# Altium schematic sheet Sheet2.SchDoc
size A4; SheetNumber: 1; SheetTotal: 1
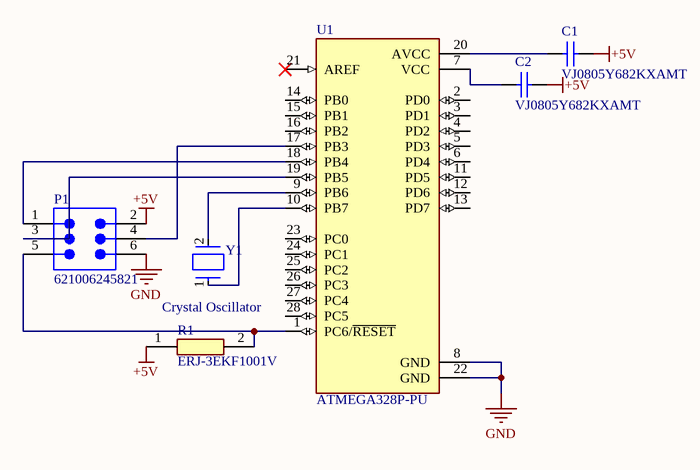
[diagram p0: Sheet2.SchDoc]

## Parts
C1  VJ0805Y682KXAMT  [CAPC2013X145X48ML20T23]
C2  VJ0805Y682KXAMT  [CAPC2013X145X48ML20T23]
P1  621006245821  [621006245821]
R1  ERJ-3EKF1001V  [RESC1608X55N]
U1  ATMEGA328P-PU  [DIP794W46P254L2967H457Q28B]
Y1  Crystal Oscillator  [FP-AB26TRB-MFG]

## Nets
+5V: C1.2 C2.2 P1.2 R1.1
GND: P1.6 U1.8(GND) U1.22(GND)
NetC1_1: C1.1 U1.20(AVCC)
NetC2_1: C2.1 U1.7(VCC)
NetP1_1: P1.1 U1.18(PB4)
NetP1_3: P1.3 U1.19(PB5)
NetP1_4: P1.4 U1.17(PB3)
NetP1_5: P1.5 R1.2 U1.1(PC6/~{RESET})
NetU1_9: U1.9(PB6) Y1.2
NetU1_10: U1.10(PB7) Y1.1

Not connected (* = marked no-connect by the designer): U1 2(PD0) 3(PD1) 4(PD2) 5(PD3) 6(PD4) 11(PD5) 12(PD6) 13(PD7) 14(PB0) 15(PB1) 16(PB2) 21(AREF)* 23(PC0) 24(PC1) 25(PC2) 26(PC3) 27(PC4) 28(PC5)

## Library data of the parts
C1 C2 = CMP-2007-03205-1: Manufacturer: Vitramon; Part Number: VJ0805Y682KXAMT
P1 = CMP-1502-00996-4: SMT Vertical Pin Header WR-PHD, Pitch 2.00 mm, Dual Row, 6 pins; Contact Resistance: 20mΩ; Gender: Male; Current Rating: 2A; Operating Supply Voltage: 200V; RoHS: Non-Compliant; Orientation: Vertical; Lead Pitch: 2mm; Number of Pins: 6
R1 = ERJ-3EKF1001V: Resistor; Manufacturer_Name: Panasonic; Datasheet Link: http://industrial.panasonic.com/cdbs/www-data/pdf/RDA0000/AOA0000C86.pdf; Height: 0.55mm; Manufacturer_Part_Number: ERJ-3EKF1001V; Mouser Part Number: 667-ERJ-3EKF1001V; Mouser Price/Stock: https://www.mouser.co.uk/ProductDetail/Panasonic/ERJ-3EKF1001V?qs=H7k1u0Mp9JTM8yQxOuvoDg%3D%3D; Arrow Part Number: ERJ-3EKF1001V; Arrow Price/Stock: https://www.arrow.com/en/products/erj-3ekf1001v/panasonic.html?utm_currency=USD&region=asia
U1 = ATMEGA328P-PU: ATmega Series 20 MHz 32 KB Flash 2 KB SRAM 8-Bit Microcontroller - DIP-28; MP: ATMEGA328P-PU; Package: None; Availability: Unavailable; Price: None; Value: *
Y1 = CMP-27762-006068-1: CRYSTAL 32.7680KHZ 12.5PF TH; Frequency Stability: -0.034ppm; Frequency Tolerance: 20ppm; Frequency: 32.768kHz; Operating Frequency: 32.768 kHz; Series Resistance: 50kR; Case/Package: Radial; Package Quantity: 500; Packaging: Tape and Reel; Lead Pitch: 2.54mm; Termination: Radial; Mount: Surface Mount; Min Operating Temperature: -40°C; REACH SVHC: No SVHC; Load Capacitance: 12.5pF; Lead Free: Lead Free; Max Operating Temperature: 85°C; Length: 6mm; Height: 0.075inch; Depth: 1.9mm; Tolerance: 20ppm; ESR (Equivalent Series Resistance): 50kR; Number of Pins: 2; Series: AB26TRB